# EAGLE schematic satstep2660 (EAGLE 9.3.1)
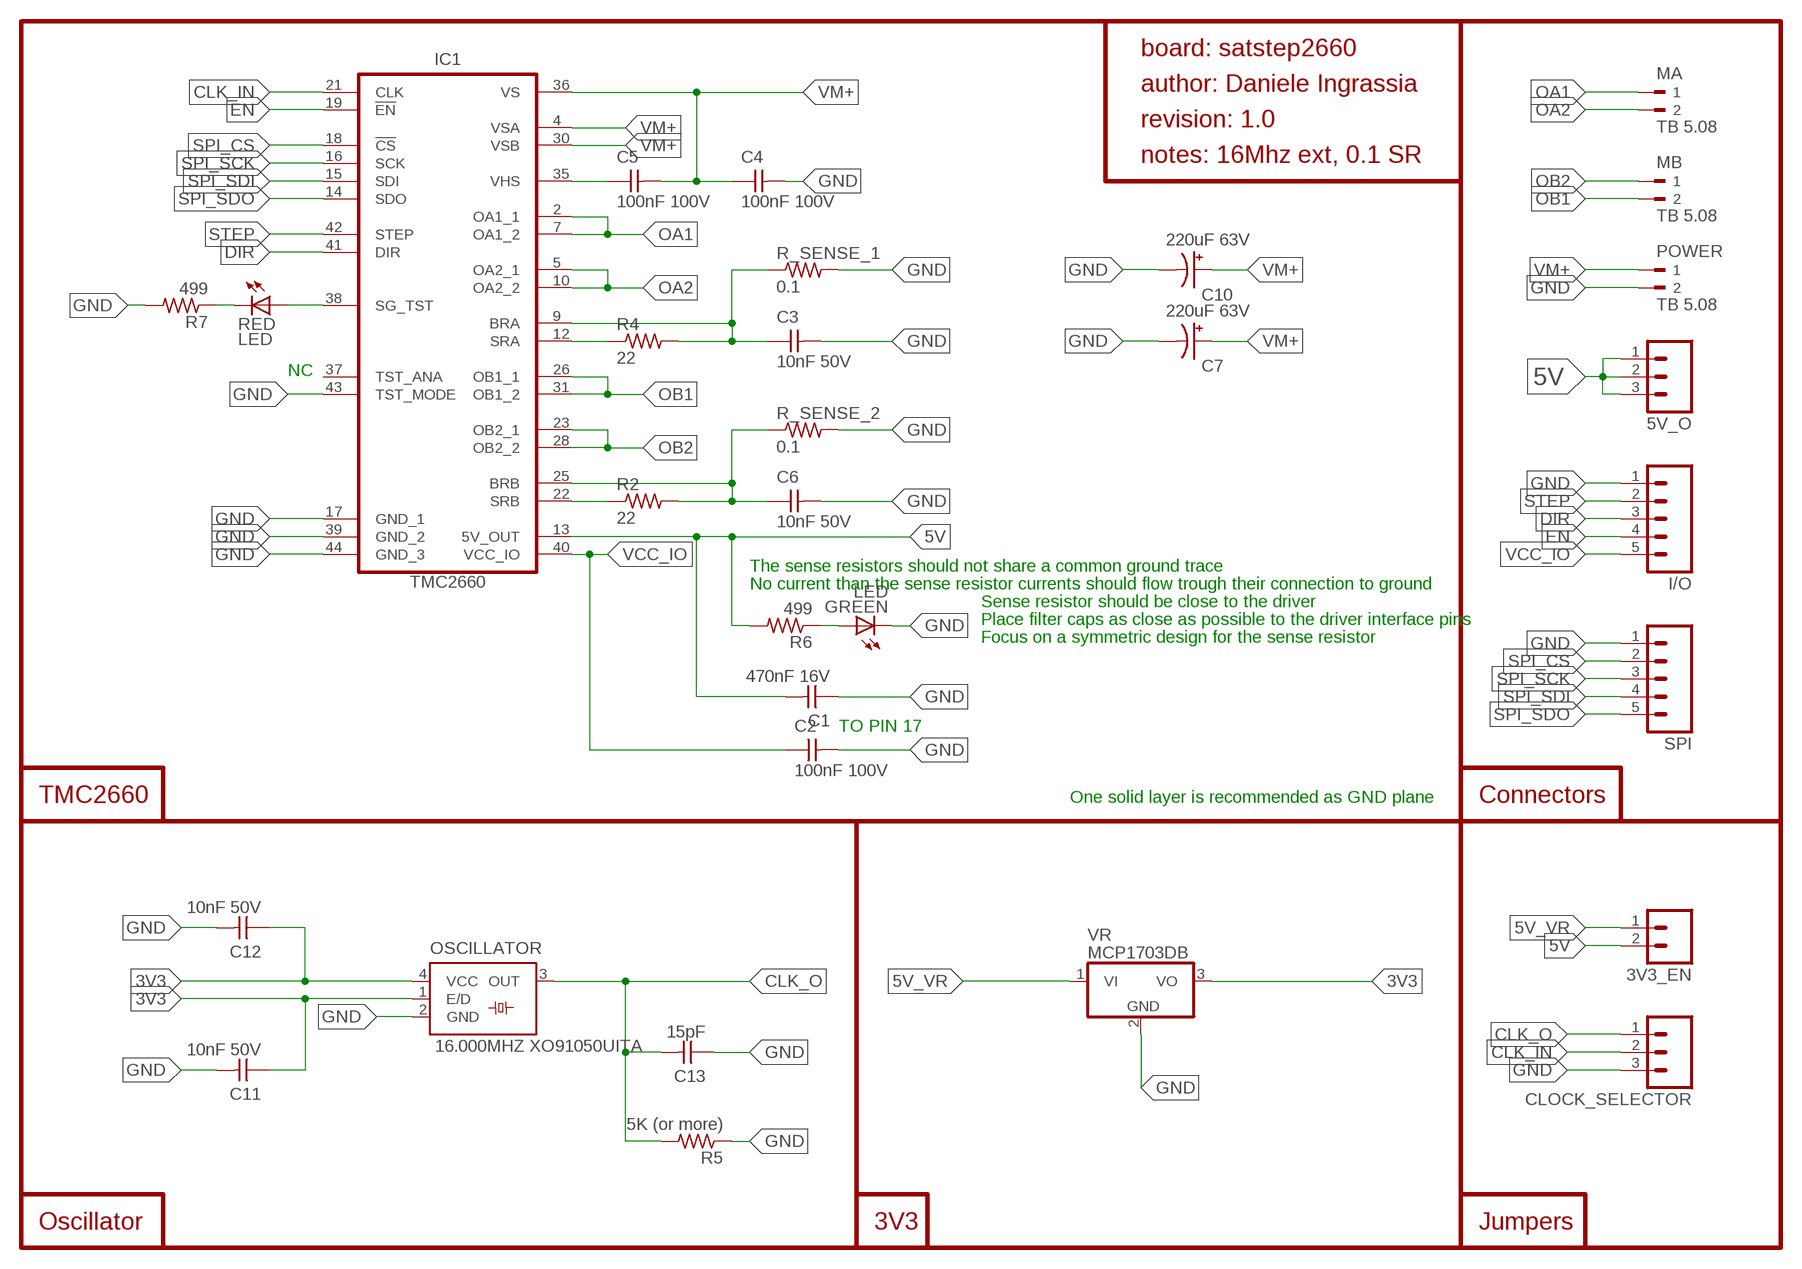
[diagram p0: schematic, sheet 1]

## Parts
3V3_EN  M02  [02P]
5V_O  M03  [03P]
C1  470nF 16V  CAP-UNPOLARIZED  [C1206]
C2  100nF 100V  CAP-UNPOLARIZED  [C1206]
C3  10nF 50V  CAP-UNPOLARIZED  [C1206]
C4  100nF 100V  CAP-UNPOLARIZED  [C1206]
C5  100nF 100V  CAP-UNPOLARIZED  [C1206]
C6  10nF 50V  CAP-UNPOLARIZED  [C1206]
C7  220uF 63V  1000UF-RADIAL-5MM-25V-20%  [CPOL-RADIAL-5MM-10MM]
C10  220uF 63V  1000UF-RADIAL-5MM-25V-20%  [CPOL-RADIAL-5MM-10MM]
C11  10nF 50V  CAP-UNPOLARIZED  [C1206]
C12  10nF 50V  CAP-UNPOLARIZED  [C1206]
C13  15pF  CAP-UNPOLARIZED  [C1206]
CLOCK_SELECTOR  M03  [03P]
GREEN  LED  [LED1206]
I/O  M05  [05P]
IC1  TMC2660  TMC2660-PA  [TMC_PQFP44_0.8_10X10_TMC236]
MA  TB 5.08  PM5.08/2/90BLK  [WEIDMULLER_PM5.08_2]
MB  TB 5.08  PM5.08/2/90BLK  [WEIDMULLER_PM5.08_2]
OSCILLATOR  16.000MHZ XO91050UITA  SM77H  [SM77H]
POWER  TB 5.08  PM5.08/2/90BLK  [WEIDMULLER_PM5.08_2]
R2  22  RES-US1206  [R1206]
R4  22  RES-US1206  [R1206]
R5  5K (or more)  RES-US1206  [R1206]
R6  499  RES-US1206  [R1206]
R7  499  RES-US1206  [R1206]
R_SENSE_1  0.1  RES-US1206  [R1206]
R_SENSE_2  0.1  RES-US1206  [R1206]
RED  LED  [LED1206]
SPI  M05  [05P]
VR  MCP1703DB  [SOT223]

## Nets
3V3: C11.1 C12.1 OSCILLATOR.1(E/D) OSCILLATOR.4(VCC) VR.3(VO)
5V: 3V3_EN.2 5V_O.1 5V_O.2 5V_O.3 C1.2 IC1.13(5V_OUT) R6.2
5V_VR: 3V3_EN.1 VR.1(VI)
BRA: C3.1 IC1.9(BRA) R4.2 R_SENSE_1.1
BRB: C6.1 IC1.25(BRB) R2.2 R_SENSE_2.1
CLK_IN: CLOCK_SELECTOR.2 IC1.21(CLK)
CLK_O: C13.2 CLOCK_SELECTOR.1 OSCILLATOR.3(OUT) R5.2
DIR: I/O.3 IC1.41(DIR)
EN: I/O.4 IC1.19(!EN)
GND: C1.1 C2.2 C3.2 C4.2 C6.2 C7.- C10.- C11.2 C12.2 C13.1 CLOCK_SELECTOR.3 GREEN.2(C) I/O.1 IC1.17(GND_1) IC1.39(GND_2) IC1.43(TST_MODE) IC1.44(GND_3) OSCILLATOR.2(GND) POWER.2 R5.1 R7.2 R_SENSE_1.2 R_SENSE_2.2 SPI.1 VR.2(GND)
N$1: C5.1 IC1.35(VHS)
N$2: GREEN.1(A) R6.1
N$3: IC1.38(SG_TST) RED.1(A)
N$4: R7.1 RED.2(C)
OA1: IC1.2(OA1_1) IC1.7(OA1_2) MA.1
OA2: IC1.5(OA2_1) IC1.10(OA2_2) MA.2
OB1: IC1.26(OB1_1) IC1.31(OB1_2) MB.2
OB2: IC1.23(OB2_1) IC1.28(OB2_2) MB.1
SPI_CS: IC1.18(!CS!) SPI.2
SPI_SCK: IC1.16(SCK) SPI.3
SPI_SDI: IC1.15(SDI) SPI.4
SPI_SDO: IC1.14(SDO) SPI.5
SRA: IC1.12(SRA) R4.1
SRB: IC1.22(SRB) R2.1
STEP: I/O.2 IC1.42(STEP)
VCC_IO: C2.1 I/O.5 IC1.40(VCC_IO)
VM+: C4.1 C5.2 C7.+ C10.+ IC1.4(VSA) IC1.30(VSB) IC1.36(VS) POWER.1
Unconnected: IC1.37(TST_ANA)

## Notes on the sheet
- board: satstep2660
- author: Daniele Ingrassia
- revision: 1.0
- notes: 16Mhz ext, 0.1 SR
- NC
- The sense resistors should not share a common ground trace
- No current than the sense resistor currents should flow trough their connection to ground
- Sense resistor should be close to the driver
- Place filter caps as close as possible to the driver interface pins
- Focus on a symmetric design for the sense resistor
- TO PIN 17
- TMC2660 | One solid layer is recommended as GND plane | Connectors
- Oscillator | 3V3 | Jumpers

## Library data of the parts
3V3_EN = con-amp-quick:M02: AMP QUICK CONNECTOR; OC_FARNELL: unknown; OC_NEWARK: unknown
5V_O CLOCK_SELECTOR = con-amp-quick:M03: AMP QUICK CONNECTOR; OC_FARNELL: unknown; OC_NEWARK: unknown
C1-C6 C11-C13 = fab:CAP-UNPOLARIZED
C7 C10 = SparkFun-Capacitors:1000UF: 1,000µF/1mF ceramic capacitors A capacitor is a passive two-terminal electrical component used to store electrical energy temporarily in an electric field. CAP-08070; PROD_ID: CAP-09538; VALUE: 1mF
GREEN RED = fab:LED: LED
I/O SPI = con-amp-quick:M05: AMP QUICK CONNECTOR; OC_FARNELL: unknown; OC_NEWARK: unknown
IC1 = TMC2660-PA:TMC2660-PA: coolStep driver with Step/Dir Interface and SPI, up to 30V, internal MOSFET for up to 4 A, PQFP-44; DATASHEET: http://www_trinamic_com/_scripts/download_php?file=_articles%2Fproducts%2Fintegrated-circuits%2Ftmc2660%2F_datasheet%2FTMC2660_datasheet_pdf; DESCRIPTION: coolStep driver with Step/Dir Interface and SPI, up to 30V, internal MOSFET for up to 4 A, PQFP-44; DISTRIBUTOR1: Digikey; GEOMETRY_HEIGHT: 1,6mm; MANUFACTURER: TRINAMIC; ORDERCODE-DISTRI1: 1460-1059-ND; ORDERCODE-MANU1: TMC2660-PA; VALUE: TMC2660-PA
MA MB POWER = satstep6600:PM5.08/2/90BLK: TERMINAL BLOCK, SIDE ENTRY, 2WAY; MPN: PM5.08/2/90 BLK; OC_FARNELL: 1131855; OC_NEWARK: 26M1980; PACKAGE: TH-R/A; SUPPLIER: WEIDMULLER
OSCILLATOR = crystal:SM77H: 3.3V CMOS Clock Oscillator Source: www.pletronics.com .. sm77h%203.3v.pdf; OC_FARNELL: unknown; OC_NEWARK: unknown
R2 R4-R7 R_SENSE_1 R_SENSE_2 = fab:RES-US: Resistor (US Symbol) Variants with postfix FAB are widened to allow the routing of internal traces
VR = satsha-ttl:MCP1703: 250 mA, 16V, Low Quiescent Current LDO Regulator Source: http://ww1.microchip.com/downloads/en/DeviceDoc/22049b.pdf

## Net classes
0 default: clearance 0.205 mm